# Altium schematic sheet mixer_30mil_1GHz.SchDoc: Mixer
size A4; Author: Almela; Revision: 1.2; SheetNumber: 2; SheetTotal: 7
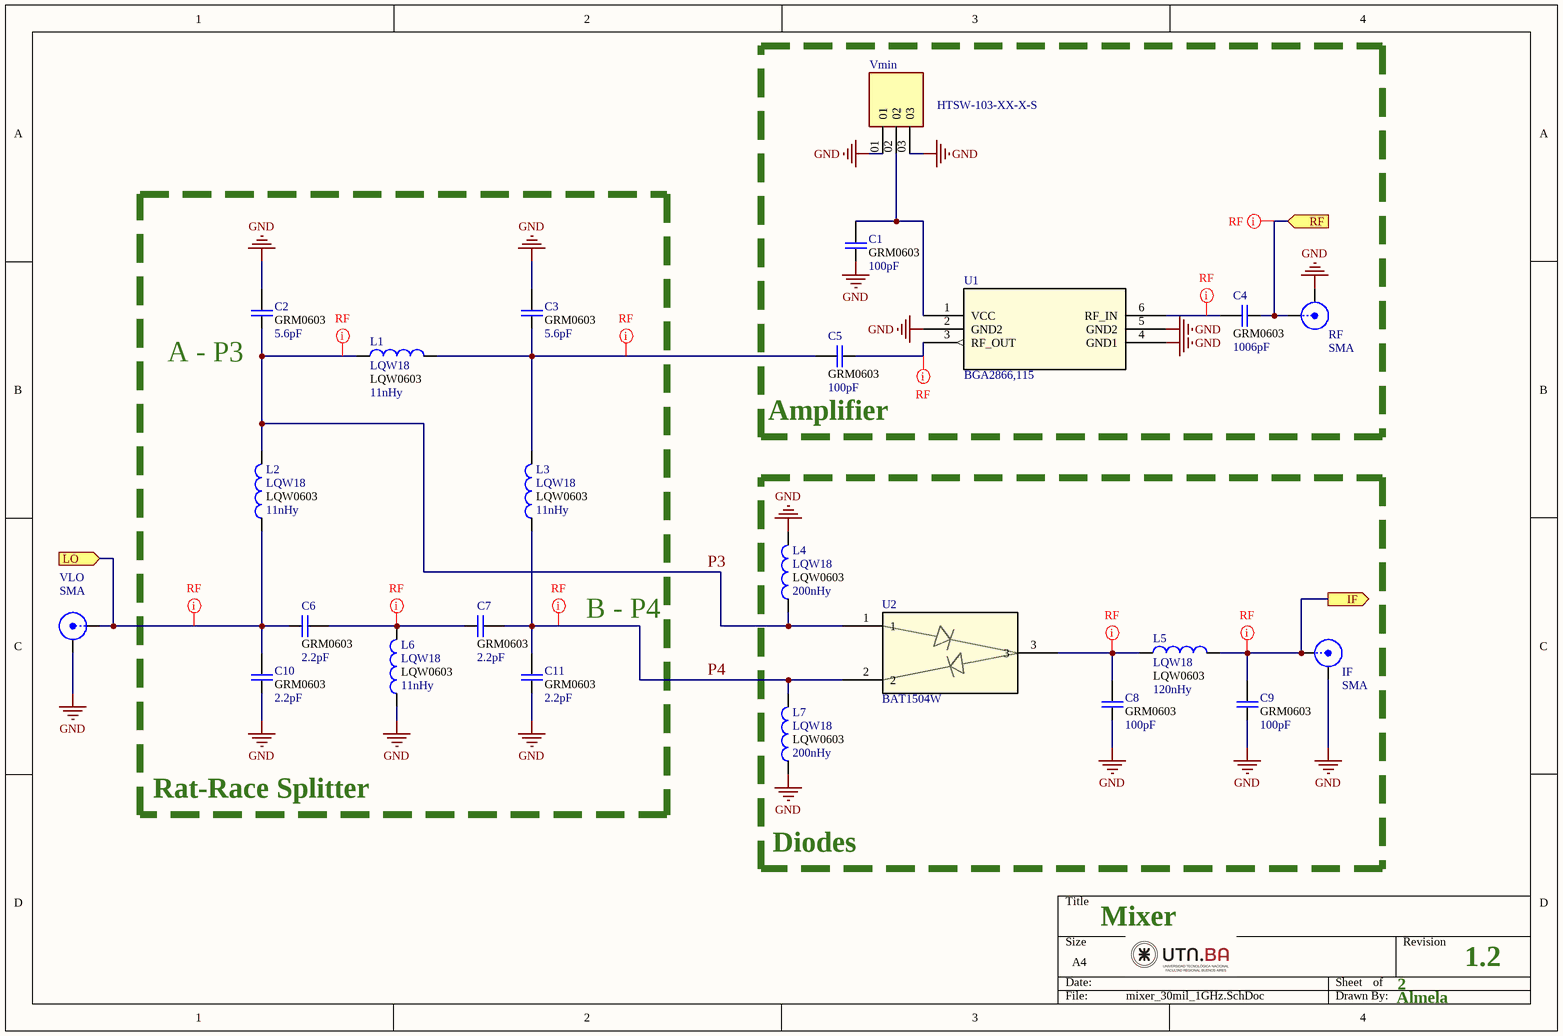
[diagram p0: mixer_30mil_1GHz.SchDoc]

## Parts
C1  value 100pF  footprint: GRM0603  [CAPC1608X90N]  (hidden comment: Cap 0603)
C2  value 5.6pF  footprint: GRM0603  [CAPC1608X90N]  (hidden comment: Cap 0603)
C3  value 5.6pF  footprint: GRM0603  [CAPC1608X90N]  (hidden comment: Cap 0603)
C4  value 1006pF  footprint: GRM0603  [CAPC1608X90N]  (hidden comment: Cap 0603)
C5  value 100pF  footprint: GRM0603  [CAPC1608X90N]  (hidden comment: Cap 0603)
C6  value 2.2pF  footprint: GRM0603  [CAPC1608X90N]  (hidden comment: Cap 0603)
C7  value 2.2pF  footprint: GRM0603  [CAPC1608X90N]  (hidden comment: Cap 0603)
C8  value 100pF  footprint: GRM0603  [CAPC1608X90N]  (hidden comment: Cap 0603)
C9  value 100pF  footprint: GRM0603  [CAPC1608X90N]  (hidden comment: Cap 0603)
C10  value 2.2pF  footprint: GRM0603  [CAPC1608X90N]  (hidden comment: Cap 0603)
C11  value 2.2pF  footprint: GRM0603  [CAPC1608X90N]  (hidden comment: Cap 0603)
IF  SMA  [SMA-142-0701-851]
L1  LQW18  value 11nHy  Parameter 1: LQW0603  [INDC1608X100N]
L2  LQW18  value 11nHy  Parameter 1: LQW0603  [INDC1608X100N]
L3  LQW18  value 11nHy  Parameter 1: LQW0603  [INDC1608X100N]
L4  LQW18  value 200nHy  Parameter 1: LQW0603  [INDC1608X100N]
L5  LQW18  value 120nHy  Parameter 1: LQW0603  [INDC1608X100N]
L6  LQW18  value 11nHy  Parameter 1: LQW0603  [INDC1608X100N]
L7  LQW18  value 200nHy  Parameter 1: LQW0603  [INDC1608X100N]
RF  SMA  [SMA-142-0701-851]
U1  BGA2866,115  [SOT363_NXP]
U2  BAT1504W  [SOT_327XTSA1_INF]
VLO  SMA  [SMA-142-0701-851]
Vmin  HTSW-103-XX-X-S  [SAMTEC_HTSW-103-XX-X-S]

## Blocks framed on the sheet
Amplifier: C1 C4 C5 RF U1 Vmin
Diodes: C8 C9 IF L4 L5 L7 U2

## Ports
IF (out), LO (in), RF (in)

## Nets
GND: C1.1 C2.2 C3.2 C8.1 C9.1 C10.1 C11.1 IF.2(Y) L4.2 L6.1 L7.1 RF.2(Y) U1.2(GND2) U1.4(GND1) U1.5(GND2) VLO.2(Y) Vmin.01 Vmin.03
IF: C9.2 IF.1(X) L5.2 ; port IF
LO: C6.1 C10.2 L2.1 VLO.1(X) ; port LO
P3: C2.1 L1.1 L2.2 L4.1 U2.1
P4: C7.2 C11.2 L3.1 L7.2 U2.2
RF: C4.1 RF.1(X) ; port RF
NetC1_2: C1.2 U1.1(VCC) Vmin.02
NetC3_1: C3.1 C5.2 L1.2 L3.2
NetC4_2: C4.2 U1.6(RF_IN)
NetC5_1: C5.1 U1.3(RF_OUT)
NetC6_2: C6.2 C7.1 L6.2
NetC8_2: C8.2 L5.1 U2.3

## Layout directives
net class RF50R: IF, LO, NetC3_1, NetC4_2, NetC5_1, NetC6_2, NetC8_2, P3, P4, RF

## Notes on the sheet
- (near C2) A - P3
- B - P4
- Rat-Race Splitter

## Library data of the parts
C1-C11 = Cap: Capacitor GRM18 0603; Published: 8-Jun-2000; LatestRevisionDate: 17-Jul-2002; LatestRevisionNote: Re-released for DXP Platform.; PackageReference: POLAR0.8; Publisher: Altium Limited; PackageDescription: Polarized Capacitor; 2 Leads; Supplier 1: Mouser
IF RF VLO = SMB: SMB Straight Connector; LatestRevisionDate: 17-Jul-2002; LatestRevisionNote: Re-released for DXP Platform.; Publisher: Altium Limited
L1-L7 = LQW18: Ind RF Chip Wirewound 18nH 5% 100MHz 40Q-Factor 550mA 0603 Paper T/R; MP: LQW18AN18NJ00D; Package: None; Price: None; Availability: Unavailable
U1 = BGA2866,115: No Description Available; Mfr_Name: NXP; RefDes: RefDes; Type: Type
U2 = BAT1504W: Diodo; Mfr_Name: Infineon; RefDes: RefDes; Type: Type
Vmin = HTSW-103-XX-X-S: Conn Unshrouded Header HDR 3 POS 2.54mm Solder ST Top Entry Thru-Hole Bag; MP: HTSW-103-08-S-S; MF: Samtec; SnapEDA_Link: https://www.snapeda.com/parts/HTSW-103-08-S-S/Samtec/view-part/?ref=snap; Purchase-URL: https://pricing.snapeda.com/search/part/HTSW-103-08-S-S/?ref=eda; Value: *; Availability: In Stock; Check_prices: https://www.snapeda.com/parts/HTSW-103-08-S-S/Samtec/view-part/?ref=eda; Package: None; Price: None